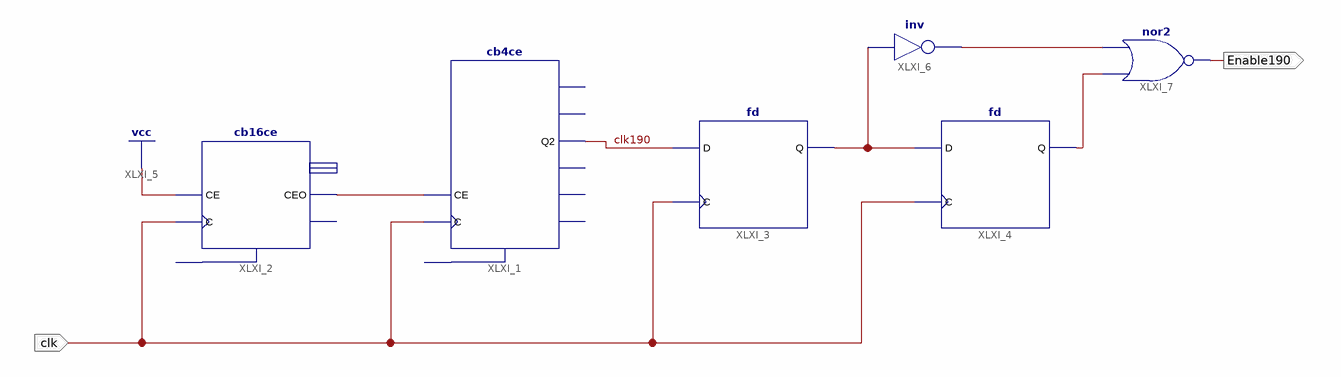
[diagram p0: schematic sheet 1]
// Xilinx ISE schematic Enable190.sch (spartan6) as structural Verilog: 6 symbols, 2 ports
module Enable190 (
  input  clk,
  output Enable190
);

  wire clk190, XLXN_9, XLXN_13, XLXN_14, XLXN_15;

  cb4ce XLXI_1 (.C(clk), .CE(XLXN_9), .Q2(clk190));  // open: CLR, CEO, Q0, Q1, Q3, TC
  cb16ce XLXI_2 (.C(clk), .CE(1'b1), .CEO(XLXN_9));  // open: CLR, Q, TC
  fd XLXI_3 (.C(clk), .D(clk190), .Q(XLXN_13));
  fd XLXI_4 (.C(clk), .D(XLXN_13), .Q(XLXN_15));
  not XLXI_6 (XLXN_14, XLXN_13);
  nor XLXI_7 (Enable190, XLXN_15, XLXN_14);
endmodule
